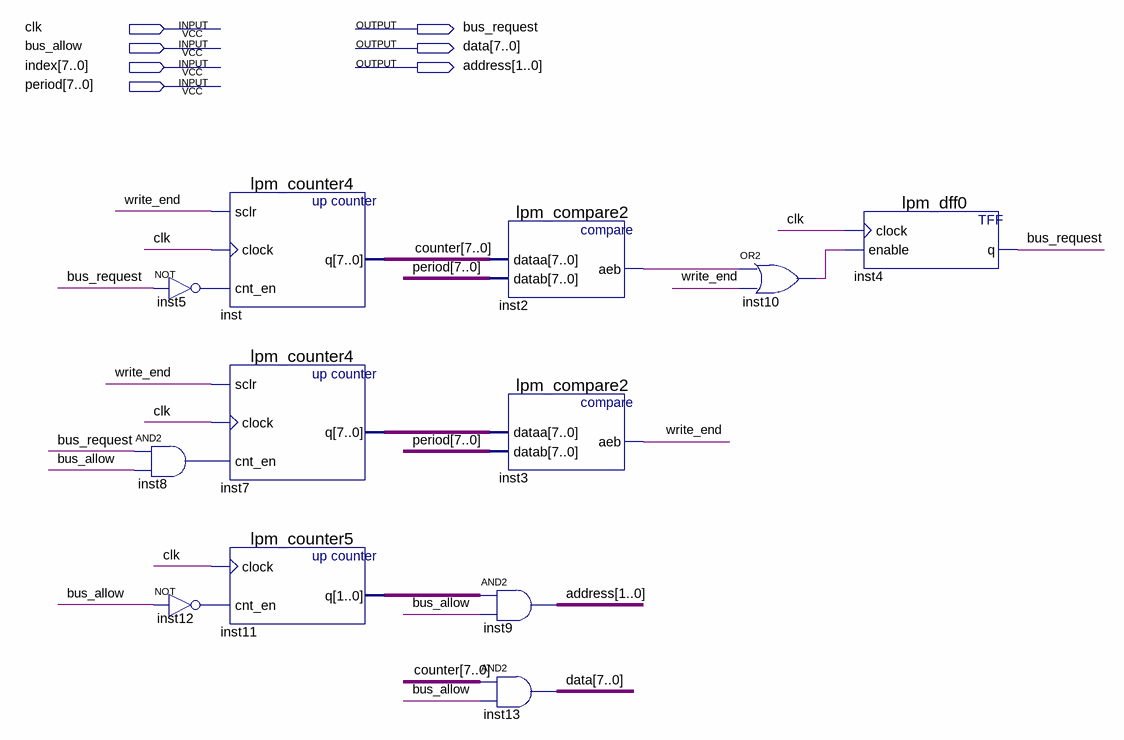
[diagram p0: schematic sheet]
// Quartus schematic Device.bdf as structural Verilog: 12 symbols, 7 pins
module Device (
  input  clk,
  input  bus_allow,
  input  [7:0] index,
  input  [7:0] period,
  output bus_request,
  output [7:0] data,
  output [1:0] address
);

  wire inst2_aeb, inst5_out, inst8_out, inst10_out, inst12_out, write_end;
  wire [1:0] inst11_q;
  wire [7:0] counter, inst7_q;

  not inst5 (inst5_out, bus_request);
  and inst8 (inst8_out, bus_request, bus_allow);
  not inst12 (inst12_out, bus_allow);
  lpm_counter4 inst (.sclr(write_end), .clock(clk), .cnt_en(inst5_out), .q(counter));
  lpm_counter4 inst7 (.sclr(write_end), .clock(clk), .cnt_en(inst8_out), .q(inst7_q));
  lpm_counter5 inst11 (.clock(clk), .cnt_en(inst12_out), .q(inst11_q));
  lpm_compare2 inst2 (.dataa(counter), .datab(period), .aeb(inst2_aeb));
  lpm_compare2 inst3 (.dataa(inst7_q), .datab(period), .aeb(write_end));
  assign address = inst11_q & {2{bus_allow}};  // AND2 inst9, 2 bits wide
  assign data = counter & {8{bus_allow}};  // AND2 inst13, 8 bits wide
  or inst10 (inst10_out, inst2_aeb, write_end);
  lpm_dff0 inst4 (.clock(clk), .enable(inst10_out), .q(bus_request));
endmodule
